# Altium schematic sheet Signal Processing.SchDoc: Signal Processing
size A; DocumentNumber: 3; SheetNumber: 3; SheetTotal: 6
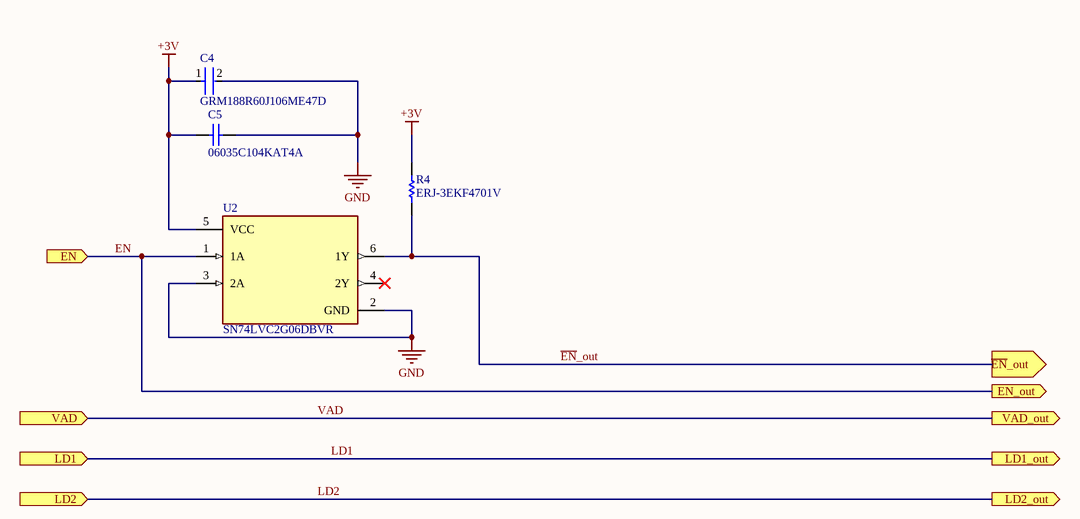
[diagram p0: Signal Processing.SchDoc]

## Parts
C4  GRM188R60J106ME47D  [FP-GRM188-0_1-e0_2_0_55-IPC_A]
C5  06035C104KAT4A  [CAPC1608X90X35LL15T15]
R4  ERJ-3EKF4701V  [RESC1608X55X30NL15T15]
U2  SN74LVC2G06DBVR  [FP-DBV0006A-IPC_A]

## Ports
EN (in), EN_out (out), LD1 (in), LD1_out (out), LD2 (in), LD2_out (out), VAD (in), VAD_out (out), ~{EN}_out (out)

## Nets
+3V: C4.1 C5.2 R4.2 U2.5(VCC)
GND: C4.2 C5.1 U2.2(GND) U2.3(2A)
~{EN}_out: R4.1 U2.6(1Y) ; port ~{EN}_out
EN: U2.1(1A) ; port EN, port EN_out
LD1: port LD1, port LD1_out
LD2: port LD2, port LD2_out
VAD: port VAD, port VAD_out

Not connected (* = marked no-connect by the designer): U2 4(2Y)*

## Library data of the parts
C4 = CMP-2006-02792-2: Chip Multilayer Ceramic Capacitors for General Purpose, 0603, 10uF, X5R, 15%, 20%, 6.3V; Packaging: Tape and Reel; Voltage Rating (DC): 6.3V; Width: 0.031inch; Termination: SMD/SMT; Dielectric: X5R; Package Quantity: 4000; Voltage Rating: 6.3V; Capacitance: 10uF; Case/Package: 0603; Min Operating Temperature: -55°C; Voltage: 6.3V; Length: 1.6mm; Thickness: 0.035inch; Lead Free: Lead Free; Depth: 0.8mm; Case Code (Imperial): 0603; Max Operating Temperature: 85°C; Material: Ceramic; Height: 0.8mm; Tolerance: 20%; Mount: Surface Mount; REACH SVHC: No SVHC; Radiation Hardening: No; Case Code (Metric): 1608
C5 = CMP-2006-04390-1: Manufacturer: AVX Interconnect / Elco; Part Number: 06035C104KAT4A
R4 = CMP-1012-00586-3: Precision Thick Film Chip Resistor, 4.7 KOhm, +/- 1%, -55 to 155 degC, 0603 (1608 Metric), RoHS, Tape and Reel; Resistance: 220 Ohm; Voltage Rating: 50 V; Elements: 4; Case\Package: 1205; Tolerance: 5%; Power Rating: 250 mW; PackageReference: 0603; Max Operating Temperature: 125 degC; REACH SVHC: No SVHC; Width: 0.063 inch; Length: 0.126 inch; Height: 0.024 inch; Mount: Surface Mount; Package Quantity: 1; DatasheetVersion: Apr-15; ComponentLink1Description: Manufacturer URL; Min Operating Temperature: -55 degC; Packaging: Tape and Reel; Radiation Hardening: No; ComponentLink2URL: http://industrial.panasonic.com/cdbs/www-data/pdf/RDA0000/AOA0000C86.pdf; Case Code (Metric): 3216; Pins: 8; Case Code (Imperial): 1206; Type (Resistor): Thick Film; RoHSCompliant: true; ComponentLink2Description: Datasheet; PackageDescription: 2-Pin Surface Mount Device, Body 1.6 x 0.85 mm; ComponentLink1URL: http://www.panasonic.com/
U2 = CMP-0859-00187-4: IC INVERTER 2CH 2-INP SOT23-6; Number of Channels: 2; Propagation Delay: 2.9ns; Min Supply Voltage: 1.65V; Polarity: Inverting; High Level Output Current: 32mA; Logic Function: Buffer; Max Supply Voltage: 5.5V; Nominal Supply Current: 40mA; Turn-On Delay Time: 7.2ns; Quiescent Current: 10uA; Number of Inputs: 1; Height: 1.15mm; Radiation Hardening: No; Length: 2.9mm; Number of Output Lines: 2; Package Quantity: 3000; Min Operating Temperature: -40°C; Case/Package: SOT-23; REACH SVHC: No SVHC; Number of Elements: 2; Number of Pins: 6; Mount: Surface Mount; Contact Plating: Gold; Number of Input Lines: 2; Number of Outputs: 2; Number of Circuits: 2; Number of Gates: 2; Max Operating Temperature: 125°C; RoHS Compliant: Yes; Low Level Output Current: 32mA; Number of Bits: 2; Width: 1.6mm; Packaging: Tape and Reel; Lead Free: Lead Free